# EAGLE design Relay_Board (EAGLE 7.7.0)
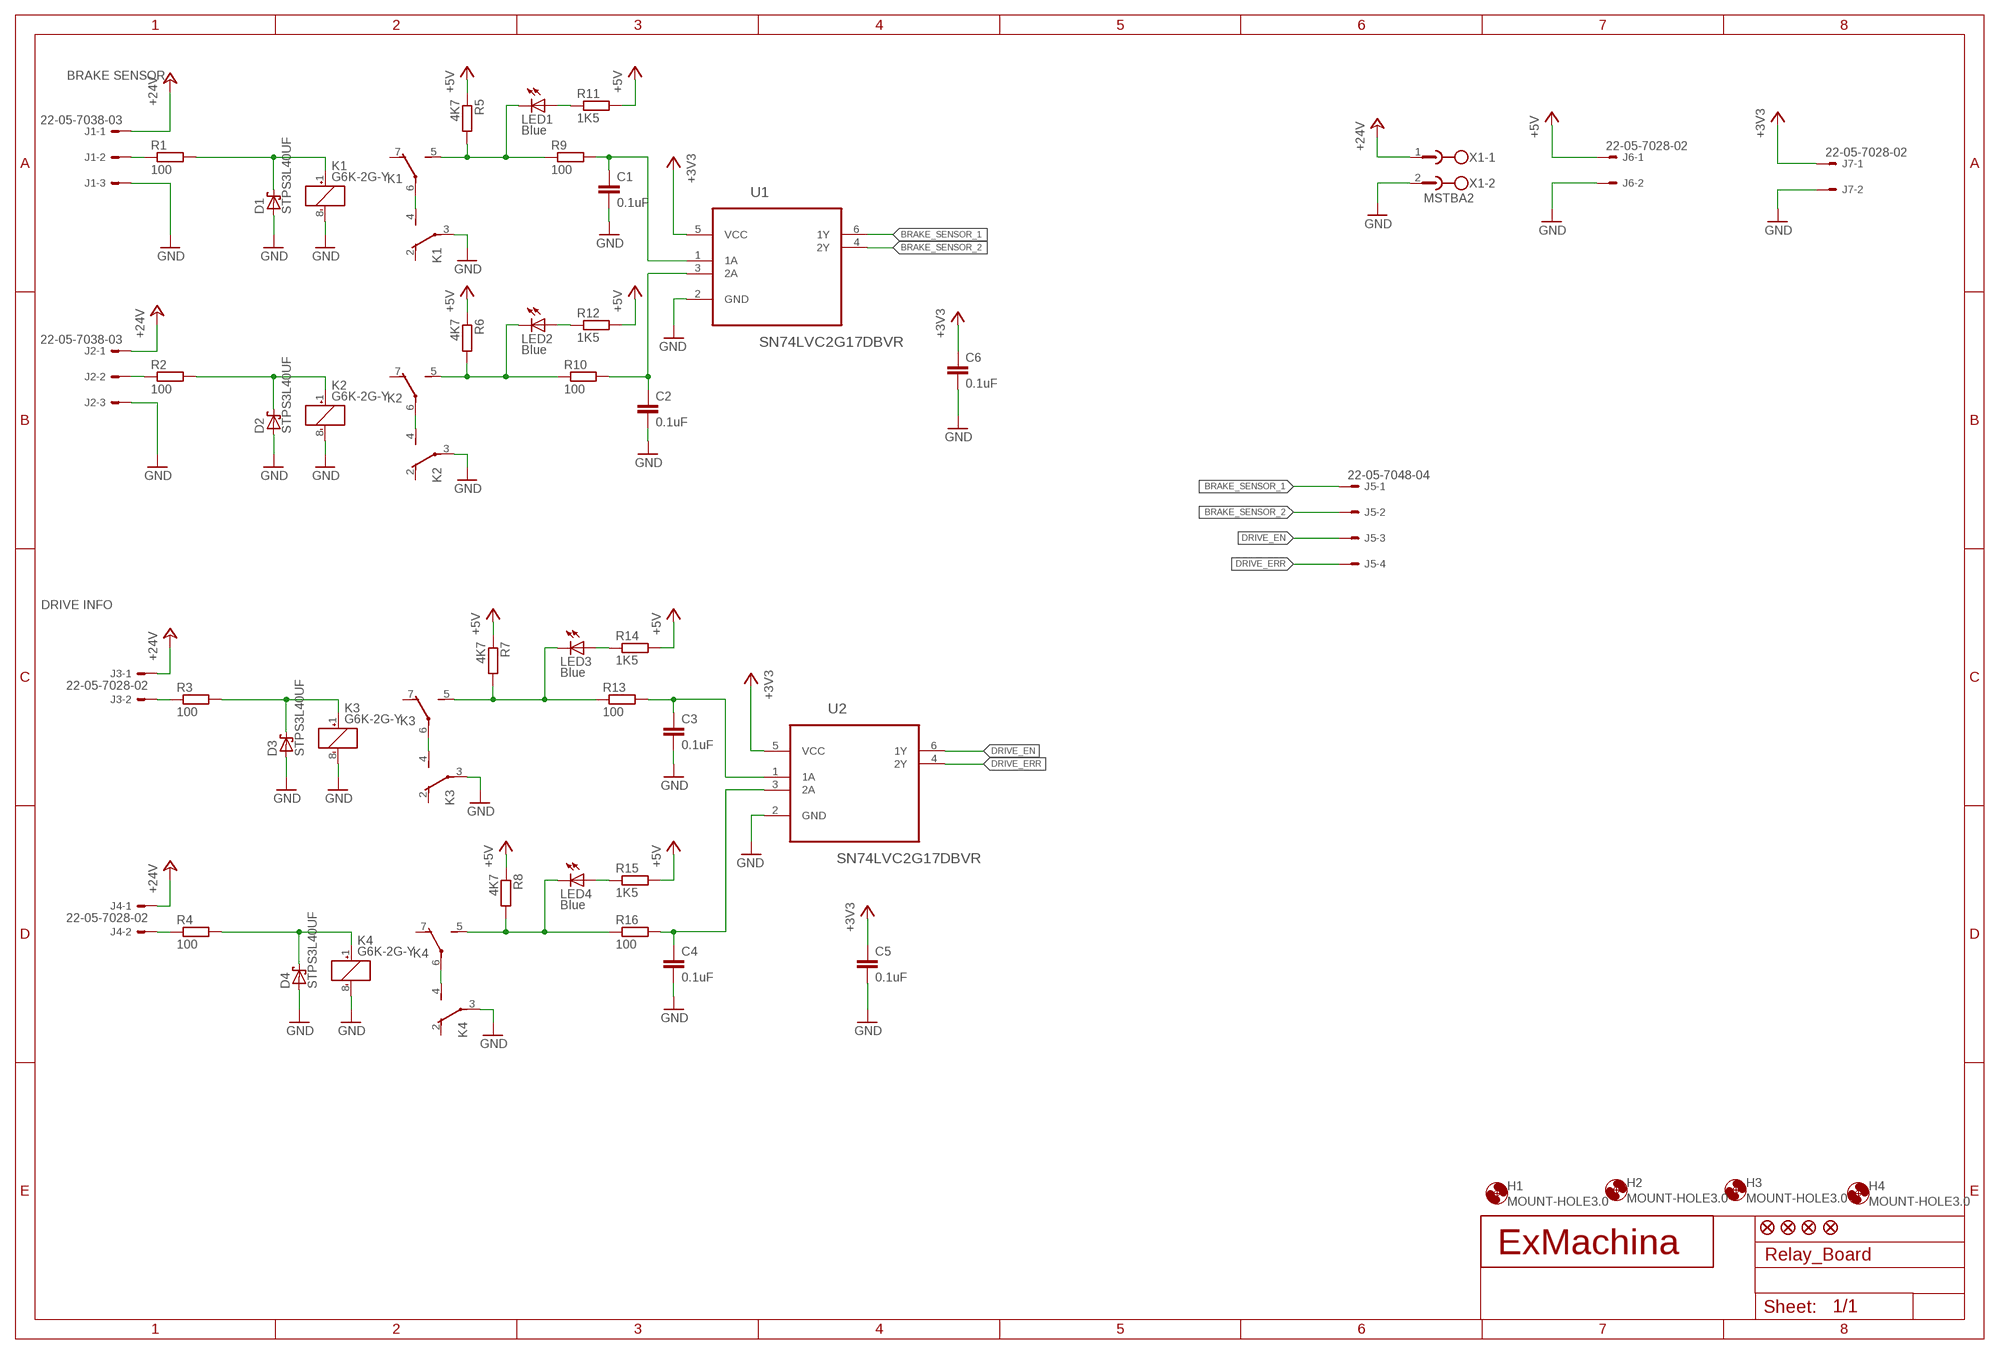
[diagram p0: schematic, sheet 1]

## Parts
C1  0.1uF  C-EUC0603  [C0603]
C2  0.1uF  C-EUC0603  [C0603]
C3  0.1uF  C-EUC0603  [C0603]
C4  0.1uF  C-EUC0603  [C0603]
C5  0.1uF  C-EUC0603  [C0603]
C6  0.1uF  C-EUC0603  [C0603]
D1  STPS3L40UF  [SMB]
D2  STPS3L40UF  [SMB]
D3  STPS3L40UF  [SMB]
D4  STPS3L40UF  [SMB]
H1  MOUNT-HOLE3.0  [3,0]
H2  MOUNT-HOLE3.0  [3,0]
H3  MOUNT-HOLE3.0  [3,0]
H4  MOUNT-HOLE3.0  [3,0]
J1  22-05-7038-03  [7395-03]
J2  22-05-7038-03  [7395-03]
J3  22-05-7028-02  [7395-02]
J4  22-05-7028-02  [7395-02]
J5  22-05-7048-04  [7395-04]
J6  22-05-7028-02  [7395-02]
J7  22-05-7028-02  [7395-02]
JP1  FIDUCIAL1X2  [FIDUCIAL-1X2]
JP2  FIDUCIAL1X2  [FIDUCIAL-1X2]
JP3  FIDUCIAL1X2  [FIDUCIAL-1X2]
JP4  FIDUCIAL1X2  [FIDUCIAL-1X2]
K1  G6K-2G-Y  [G6K-2G-Y]
K2  G6K-2G-Y  [G6K-2G-Y]
K3  G6K-2G-Y  [G6K-2G-Y]
K4  G6K-2G-Y  [G6K-2G-Y]
LED1  Blue  LEDCHIPLED_0603  [CHIPLED_0603]
LED2  Blue  LEDCHIPLED_0603  [CHIPLED_0603]
LED3  Blue  LEDCHIPLED_0603  [CHIPLED_0603]
LED4  Blue  LEDCHIPLED_0603  [CHIPLED_0603]
R1  100  R-EU_R0603  [R0603]
R2  100  R-EU_R0603  [R0603]
R3  100  R-EU_R0603  [R0603]
R4  100  R-EU_R0603  [R0603]
R5  4K7  R-EU_R0603  [R0603]
R6  4K7  R-EU_R0603  [R0603]
R7  4K7  R-EU_R0603  [R0603]
R8  4K7  R-EU_R0603  [R0603]
R9  100  R-EU_R0603  [R0603]
R10  100  R-EU_R0603  [R0603]
R11  1K5  R-EU_R0603  [R0603]
R12  1K5  R-EU_R0603  [R0603]
R13  100  R-EU_R0603  [R0603]
R14  1K5  R-EU_R0603  [R0603]
R15  1K5  R-EU_R0603  [R0603]
R16  100  R-EU_R0603  [R0603]
T1  EXMACHINA-LOGO-NAME  [EXM-LOGO-BASELINE]
U1  SN74LVC2G17DBVR  [SOT95P280X145-6N]
U2  SN74LVC2G17DBVR  [SOT95P280X145-6N]
X1  MSTBA2  [MSTBA2]

## Nets
+3V3 [supply]: C5.1 C6.1 J7.1 U1.5(VCC) U2.5(VCC)
+5V [supply]: J6.1 R5.1 R6.1 R7.1 R8.1 R11.2 R12.2 R14.2 R15.2
+24V: J1.1 J2.1 J3.1 J4.1 X1.1
BRAKE_SENSOR_1: J5.1 U1.6(1Y)
BRAKE_SENSOR_2: J5.2 U1.4(2Y)
DRIVE_EN: J5.3 U2.6(1Y)
DRIVE_ERR: J5.4 U2.4(2Y)
GND [supply]: C1.2 C2.2 C3.2 C4.2 C5.2 C6.2 D1.A D2.A D3.A D4.A J1.3 J2.3 J6.2 J7.2 K1.3(2:P) K1.8(1:-) K2.3(2:P) K2.8(1:-) K3.3(2:P) K3.8(1:-) K4.3(2:P) K4.8(1:-) U1.2(GND) U2.2(GND) X1.2
N$21: J1.2 R1.1
N$23: J2.2 R2.1
N$24: D1.C K1.1(1:+) R1.2
N$28: D3.C K3.1(1:+) R3.2
N$29: K1.4(2:S) K1.6(3:P)
N$32: J3.2 R3.1
N$33: D4.C K4.1(1:+) R4.2
N$37: J4.2 R4.1
N$38: C2.1 R10.2 U1.3(2A)
N$39: C1.1 R9.2 U1.1(1A)
N$41: C3.1 R13.2 U2.1(1A)
N$42: C4.1 R16.2 U2.3(2A)
N$55: D2.C K2.1(1:+) R2.2
N$57: K2.4(2:S) K2.6(3:P)
N$58: K1.5(3:S) LED1.C R5.2 R9.1
N$59: K4.4(2:S) K4.6(3:P)
N$60: K3.4(2:S) K3.6(3:P)
N$70: LED1.A R11.1
N$71: K2.5(3:S) LED2.C R6.2 R10.1
N$72: LED2.A R12.1
N$73: K3.5(3:S) LED3.C R7.2 R13.1
N$74: LED3.A R14.1
N$75: K4.5(3:S) LED4.C R8.2 R16.1
N$76: LED4.A R15.1
Unconnected: K1.2(2:O) K1.7(3:O) K2.2(2:O) K2.7(3:O) K3.2(2:O) K3.7(3:O) K4.2(2:O) K4.7(3:O)

## Notes on the sheet
- BRAKE SENSOR
- DRIVE INFO

## Library data of the parts
C1-C6 = rcl:C-EU: CAPACITOR, European symbol; MPN: MC0603B104K250CT; OC_NEWARK: 06R4925
D1-D4 = diode:STPS3L40?; MP: STMICROELECTRONICS; MPN: STPS3L40UF; OC_FARNELL: 2341599; OC_NEWARK: 06X0873
H1-H4 = holes:MOUNT-HOLE: MOUNTING HOLE with drill center marker; OC_NEWARK: unknown
J1 J2 = con-molex:22-?-03: CONNECTOR wire to board 2.54 mm (.1 inch) pitch header; MPN: 22-05-7038; OC_FARNELL: 9731610; OC_NEWARK: 26M6362
J3 J4 J6 J7 = con-molex:22-?-02: CONNECTOR wire to board 2.54 mm (.1 inch) pitch header; MPN: 22-05-7028; OC_FARNELL: 9731601; OC_NEWARK: 25M1728
J5 = con-molex:22-?-04: CONNECTOR wire to board 2.54 mm (.1 inch) pitch header; MPN: 22-05-7048; OC_FARNELL: unknown; OC_NEWARK: 26M6363
JP1-JP4 = SparkFun:FIDUCIAL: Fiducial Alignment Points Various fiducial points for machine vision alignment.; OC_NEWARK: unknown
K1-K4 = relay:G6K: Low Signal Relay oeiwcsnts1.omron.com/.. D20G6K0100.pdf; MPN: G6K-2G-Y 24DC; OC_FARNELL: 4484794; OC_NEWARK: 82T9378
LED1-LED4 = led:LED: LED OSRAM: - CHIPLED LG R971, LG N971, LY N971, LG Q971, LY Q971, LO R971, LY R971 LH N974, LH R974 LS Q976, LO Q976, LY Q976 LO Q996 - Hyper CHIPLED LW Q18S LB Q993, LB Q99A, LB R99A - SideLED LS A670, LO A670, LY A670, LG A670, LP A670 LB A673, LV A673, LT A673, LW A673 LH A674 LY A675 LS A676, LA A676, LO A676, LY A676, LW A676 LS A679, LY A679, LG A679 - Hyper Micro SIDELED® LS Y876, LA Y876, LO Y876, LY Y876 LT Y87S - SmartLED LW L88C, LW L88S LB L89C, LB L89S, LG L890 LS L89K, LO L89K, LY L89K LS L896, LA L896, LO L896, LY L896 - TOPLED LS T670, LO T670, LY T670, LG T670, LP T670 LSG T670, LSP T670, LSY T670, LOP T670, LYG T670 LG T671, LOG T671, LSG T671 LB T673, LV T673, LT T673, LW T673 LH T674 LS T676, LA T676, LO T676, LY T676, LB T676, LH T676, LSB T676, LW T676 LB T67C, LV T67C, LT T67C, LS T67K, LO T67K, LY T67K, LW E67C LS E67B, LA E67B, LO E67B, LY E67B, LB E67C, LV E67C, LT E67C LW T67C LS T679, LY T679, LG T679 LS T770, LO T770, LY T770, LG T770, LP T770 LB T773, LV T773, LT T773, LW T773 LH T774 LS E675, LA E675, LY E675, LS T675 LS T776, LA T776, LO T776, LY T776, LB T776 LHGB T686 LT T68C, LB T68C - Hyper Mini TOPLED® LB M676 - Mini TOPLED Santana® LG M470 LS M47K, LO M47K, LY M47K Source: http://www.osram.convergy.de LUXEON: - LUMILED® LXK2-PW12-R00, LXK2-PW12-S00, LXK2-PW14-U00, LXK2-PW14-V00 LXK2-PM12-R00, LXK2-PM12-S00, LXK2-PM14-U00 LXK2-PE12-Q00, LXK2-PE12-R00, LXK2-PE12-S00, LXK2-PE14-T00, LXK2-PE14-U00 LXK2-PB12-K00, LXK2-PB12-L00, LXK2-PB12-M00, LXK2-PB14-N00, LXK2-PB14-P00, LXK2-PB14-Q00 LXK2-PR12-L00, LXK2-PR12-M00, LXK2-PR14-Q00, LXK2-PR14-R00 LXK2-PD12-Q00, LXK2-PD12-R00, LXK2-PD12-S00 LXK2-PH12-R00, LXK2-PH12-S00 LXK2-PL12-P00, LXK2-PL12-Q00, LXK2-PL12-R00 Source: www.luxeon.com KINGBRIGHT: KA-3528ASYC Source: www.kingbright.com; MPN: OVS-0603; OC_NEWARK: 15R2205
R1-R4 R9 R10 R13 R16 = rcl:R-EU_: RESISTOR, European symbol; MPN: MCMR06X1000FTL; OC_NEWARK: 86T3504
R5-R8 = rcl:R-EU_: RESISTOR, European symbol; MPN: MCMR06X4701FTL; OC_NEWARK: 86T3649
R11 R12 R14 R15 = rcl:R-EU_: RESISTOR, European symbol; MPN: MCMR06X1501FTL; OC_NEWARK: 86T3542
T1 = exmachina:EXMACHINA-LOGO; OC_NEWARK: unknown
U1 U2 = ti:SN74LVC2G17DBVR: DUAL SCHMITT-TRIGGER BUFFER; MF: TEXAS INSTRUMENTS; MPN: SN74LVC2G17DBVR; OC_FARNELL: 1470776; OC_NEWARK: 76C4207; PACKAGE: SOT-23-6; SUPPLIER: Texas Instruments
X1 = con-phoenix-508:MSTBA2: PHOENIX; MF: FARNELL; MPN: 1757242; OC_FARNELL: 3705171; OC_NEWARK: 71C4161

## Net classes
2 supply: width 0.008 mm, drill 0.5 mm

## Board
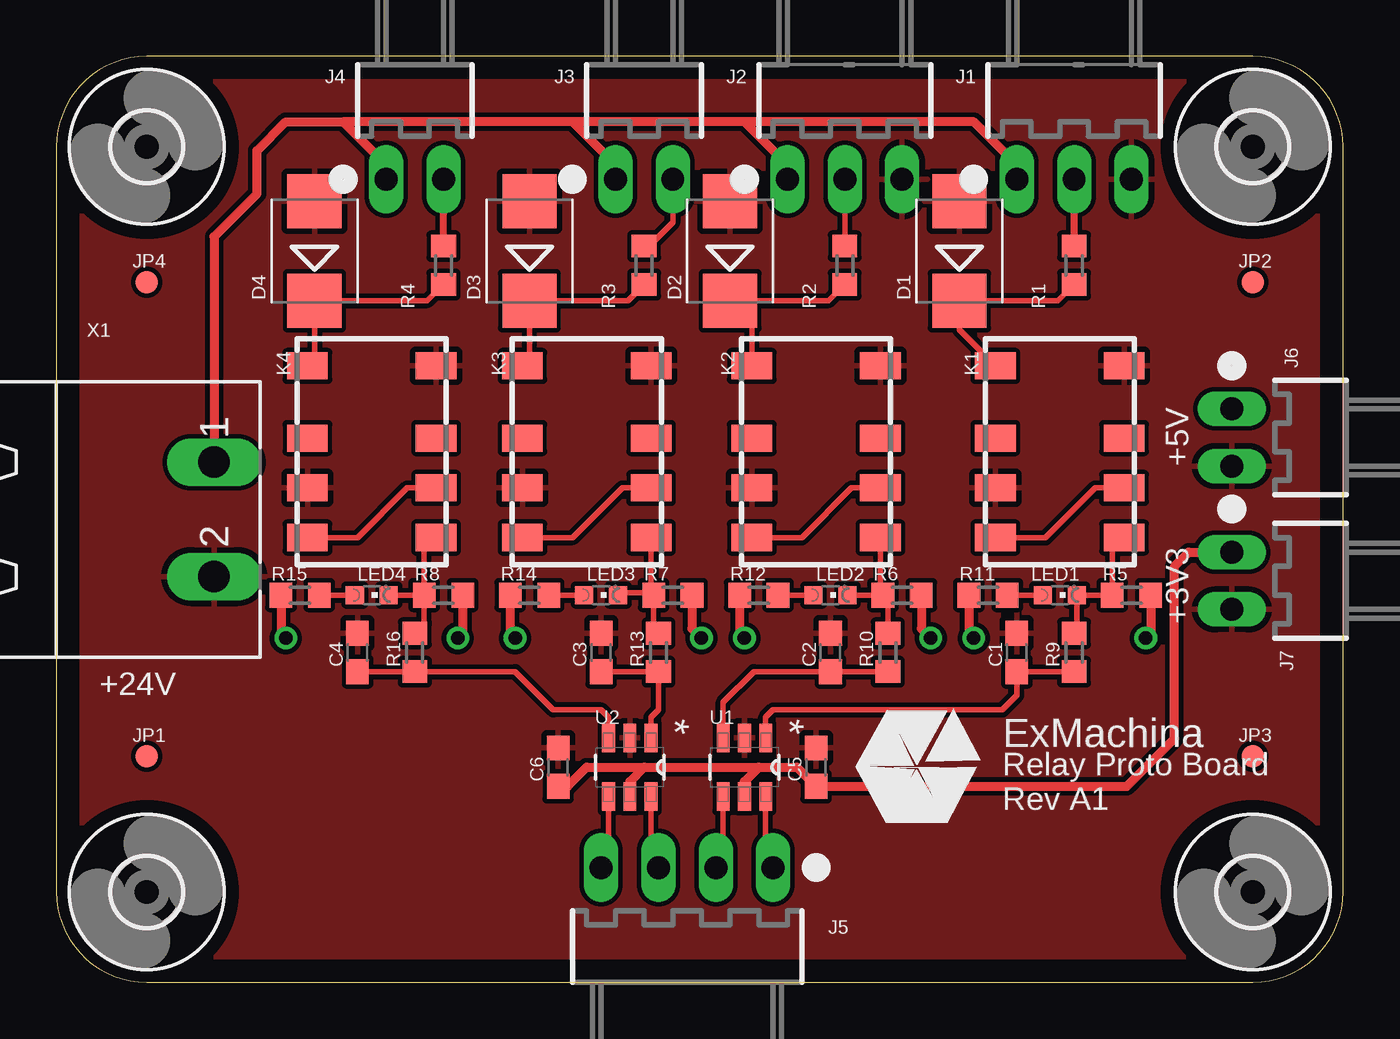
[diagram p1: board, top side]
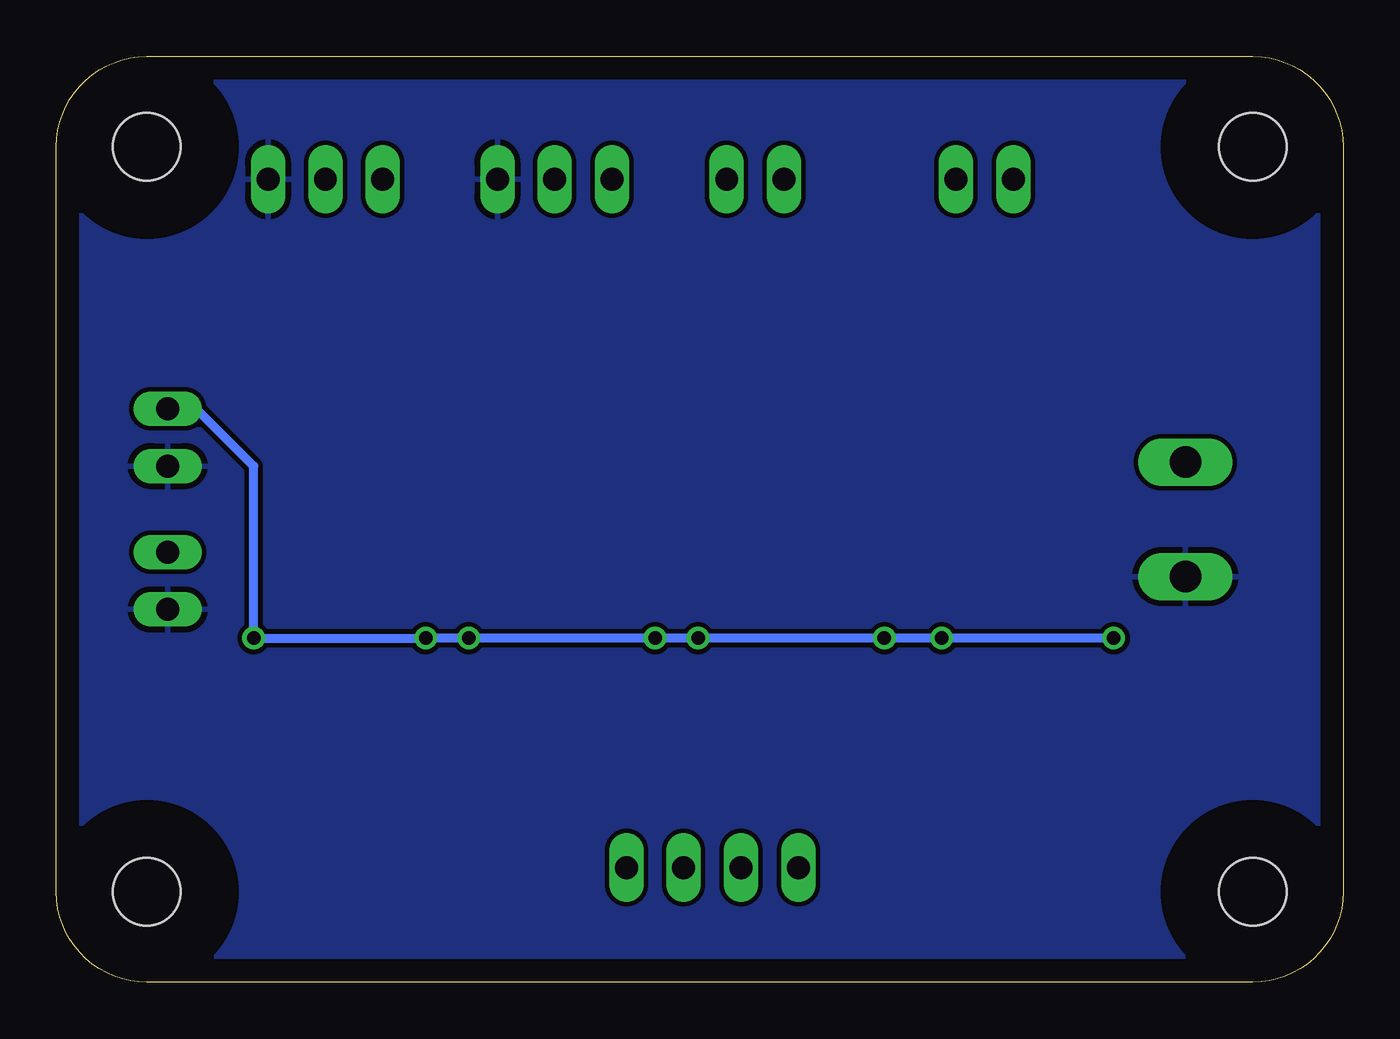
[diagram p2: board, bottom side, seen from below]

Size 57 x 41 mm. Coordinates in mm from the lower left corner, seen from the top.
Outline: 0,37 0,4 arc90 4,0 53,0 arc90 57,4 57,37 arc90 53,41 4,41 arc90 0,37
Copper layers (1*16): Top 0.035mm / dielectric 1.5mm / Bottom 0.035mm
Design rules "default *": minimum track width 10mil, minimum drill 0.6mm, track to track 8mil, track to pad 8mil, pad to pad 8mil, via to via 8mil, smd to smd 8mil, copper to edge 40mil, drill to drill 8mil, minimum pad ring 10mil, minimum via ring 8mil, stop-mask expansion 4mil, vias tented up to drill 0mil, thermal gap 10mil

### Footprints (pad centres in the part's own frame; a part is rotated, then mirrored left to right if it is on the bottom)
C0603 = smd 1.1 x 1: 1 -0.85,0; 2 0.85,0
SMB = smd 2.4 x 2.4: A 2.2,0; C -2.2,0
3,0 = hole 3: 0,0
7395-03 = drill 1.016 long: 1 2.54,0; 2 0,0; 3 -2.54,0
7395-02 = drill 1.016 long: 1 1.27,0; 2 -1.27,0
7395-04 = drill 1.016 long: 1 3.81,0; 2 1.27,0; 3 -1.27,0; 4 -3.81,0
FIDUCIAL-1X2 = smd 1 x 1: 1 0,0
G6K-2G-Y = smd 1.2 x 1.8: 1 -3.8,-2.85; 2 -0.6,-2.85; 3 1.6,-2.85; 4 3.8,-2.85; 5 3.8,2.85; 6 1.6,2.85; 7 -0.6,2.85; 8 -3.8,2.85
CHIPLED_0603 = smd 0.8 x 0.8: A 0,-0.75; C 0,0.75
R0603 = smd 1 x 1.1: 1 -0.85,0; 2 0.85,0
SOT95P280X145-6N = smd 1.27 x 0.559: 1 -1.295,0.94; 2 -1.295,0; 3 -1.295,-0.94; 4 1.295,-0.94; 5 1.295,0; 6 1.295,0.94
MSTBA2 = drill 1.397 long: 1 -2.54,5.08; 2 2.54,5.08

### Placement (x,y rotation side)
C1  42.55,14.61 90 top
C2  34.29,14.61 90 top
C3  24.13,14.61 90 top
C4  13.34,14.61 90 top
C5  33.66,9.53 90 top
C6  22.23,9.53 90 top
D1  40.01,32.38 90 top
D2  29.84,32.38 90 top
D3  20.95,32.38 90 top
D4  11.43,32.38 90 top
H1  4,4 0 top
H2  4,37 0 top
H3  53,4 0 top
H4  53,37 0 top
J1  45.09,35.56 180 top
J2  34.92,35.56 180 top
J3  26.04,35.56 180 top
J4  15.88,35.56 180 top
J5  27.94,5.08 0 top
J6  52.07,24.13 90 top
J7  52.07,17.78 90 top
JP1  4,10 0 top
JP2  53,31 0 top
JP3  53,10 0 top
JP4  4,31 0 top
K1  44.45,23.5 270 top
K2  33.66,23.5 270 top
K3  23.5,23.5 270 top
K4  13.97,23.5 270 top
LED1  44.45,17.14 270 top
LED2  34.29,17.14 270 top
LED3  24.13,17.14 270 top
LED4  13.97,17.14 270 top
R1  45.09,31.75 270 top
R2  34.92,31.75 270 top
R3  26.04,31.75 270 top
R4  17.14,31.75 270 top
R5  47.62,17.14 180 top
R6  37.47,17.14 180 top
R7  27.3,17.14 180 top
R8  17.14,17.14 180 top
R9  45.09,14.61 270 top
R10  36.83,14.61 270 top
R11  41.27,17.14 180 top
R12  31.11,17.14 180 top
R13  26.67,14.61 270 top
R14  20.95,17.14 180 top
R15  10.79,17.14 180 top
R16  15.88,14.61 270 top
T1  38.1,9.53 0 top
U1  30.48,9.53 270 top
U2  25.4,9.53 270 top
X1  1.91,20.5 270 top

### Tracks (layer width: path | path; a pad name or v marks a point on that pad's centre or on a via)
+3V3
  Top 0.254: U2.5 25.4,8.89 | U1.5 30.48,8.89
  Top 0.406: C6.1 22.64,8.68 23.5,9.53 26.04,9.53 | 26.04,9.53 31.11,9.53 | 31.11,9.53 32.8,9.53 C5.1 47.41,8.68 49.53,10.79 49.53,18.41 50.16,19.05 J7.1 | 25.4,8.89 26.04,9.53 | 30.48,8.89 31.11,9.53
+5V  (via drill 0.6)
  Top 0.406: R15.2 9.95,15.46 v10.16,15.24 | R8.1 18,15.46 v17.78,15.24 | R14.2 20.11,15.46 v20.32,15.24 | R7.1 28.16,15.66 v28.57,15.24 | R12.2 30.27,15.46 v30.48,15.24 | R6.1 38.31,15.66 v38.73,15.24 | R11.2 40.42,15.46 v40.64,15.24 | R5.1 48.48,15.46 v48.26,15.24
  Bottom 0.406: v10.16,15.24 v17.78,15.24 v20.32,15.24 v28.57,15.24 v30.48,15.24 v38.73,15.24 v40.64,15.24 v48.26,15.24 48.26,22.86 50.8,25.4 J6.1
+24V
  Top 0.406: 30.48,38.1 40.64,38.1 42.55,36.2 J1.1 | 30.48,38.1 22.86,38.1 | 22.86,38.1 12.7,38.1 | X1.1 6.99,33.02 8.89,34.92 8.89,36.83 10.16,38.1 12.7,38.1 | J4.1 14.61,36.2 12.7,38.1 | J2.1 32.38,36.2 30.48,38.1 | J3.1 24.77,36.2 22.86,38.1
BRAKE_SENSOR_1
  Top 0.254: J5.1 31.42,5.41 U1.6
BRAKE_SENSOR_2
  Top 0.254: J5.2 29.54,5.41 U1.4
DRIVE_EN
  Top 0.254: J5.3 26.34,5.41 U2.6
DRIVE_ERR
  Top 0.254: J5.4 24.46,5.41 U2.4
GND
  pour Bottom: -1.27,43.18 62.23,43.18 62.23,25.4 62.23,-6.35 36.83,-6.35 -1.27,-6.35
  pour Top: -2.54,44.45 63.5,44.45 63.5,-7.62 -2.54,-7.62
N$21
  Top 0.305: R1.1 J1.2
N$23
  Top 0.254: R2.1 J2.2
N$24
  Top 0.254: K1.1 40.01,28.89 D1.C 44.37,30.18 R1.2
N$28
  Top 0.254: D3.C 20.66,30.48 20.32,30.48 | K3.1 20.95,27.61 D3.C | D3.C 25.32,30.18 R3.2
N$29
  Top 0.254: K1.4 41.61,19.68 43.81,19.68 46.02,21.89 K1.6
N$32
  Top 0.254: J3.2 27.3,33.66 26.25,32.6 R3.1
N$33
  Top 0.254: R4.2 16.43,30.18 D4.C 11.43,27.61 K4.1
N$37
  Top 0.305: R4.1 J4.2
N$38
  Top 0.254: U1.3 29.54,12.39 30.9,13.76 C2.1 R10.2
N$39
  Top 0.254: R9.2 C1.1 42.55,12.7 41.91,12.06 31.75,12.06 31.42,11.73 U1.1
N$41
  Top 0.254: C3.1 R13.2 26.67,12.06 26.34,11.73 U2.1
N$42
  Top 0.254: C4.1 R16.2 20.32,13.76 22.01,12.06 24.13,12.06 24.46,11.73 U2.3
N$55
  Top 0.254: R2.2 34.21,30.18 D2.C 30.8,29.23 K2.1
  Top 0.305: K2.1 30.82,27.3
N$57
  Top 0.254: K2.4 30.82,19.68 33.02,19.68 35.23,21.89 K2.6
N$58
  Top 0.254: K1.5 46.77,19.17 R5.2 LED1.C 45.2,15.57 R9.1
N$59
  Top 0.254: K4.4 11.13,19.68 13.34,19.68 15.54,21.89 K4.6
N$60
  Top 0.254: K3.4 22.87,19.7 25.07,21.89 K3.6
N$70
  Top 0.254: R11.1 LED1.A
N$71
  Top 0.254: R6.2 LED2.C | R6.2 36.83,16.93 R10.1 | K2.5 36.51,17.25 R6.2
N$72
  Top 0.254: R12.1 LED2.A
N$73
  Top 0.254: R13.1 26.45,15.67 R7.2 26.34,17.25 | K3.5 26.34,17.25 | 26.34,17.25 24.99,17.25 LED3.C
N$74
  Top 0.254: R14.1 LED3.A
N$75
  Top 0.254: R16.1 16.3,15.88 R8.2 | LED4.C R8.2 | R8.2 16.3,19.17 K4.5
N$76
  Top 0.254: R15.1 LED4.A

### Text on the board
tPlace: +5V | +3V3 | +24V | Relay Proto Board / Rev A1